# Altium project STM32WL_UFQFPN48_Reference_Design.PrjPcb
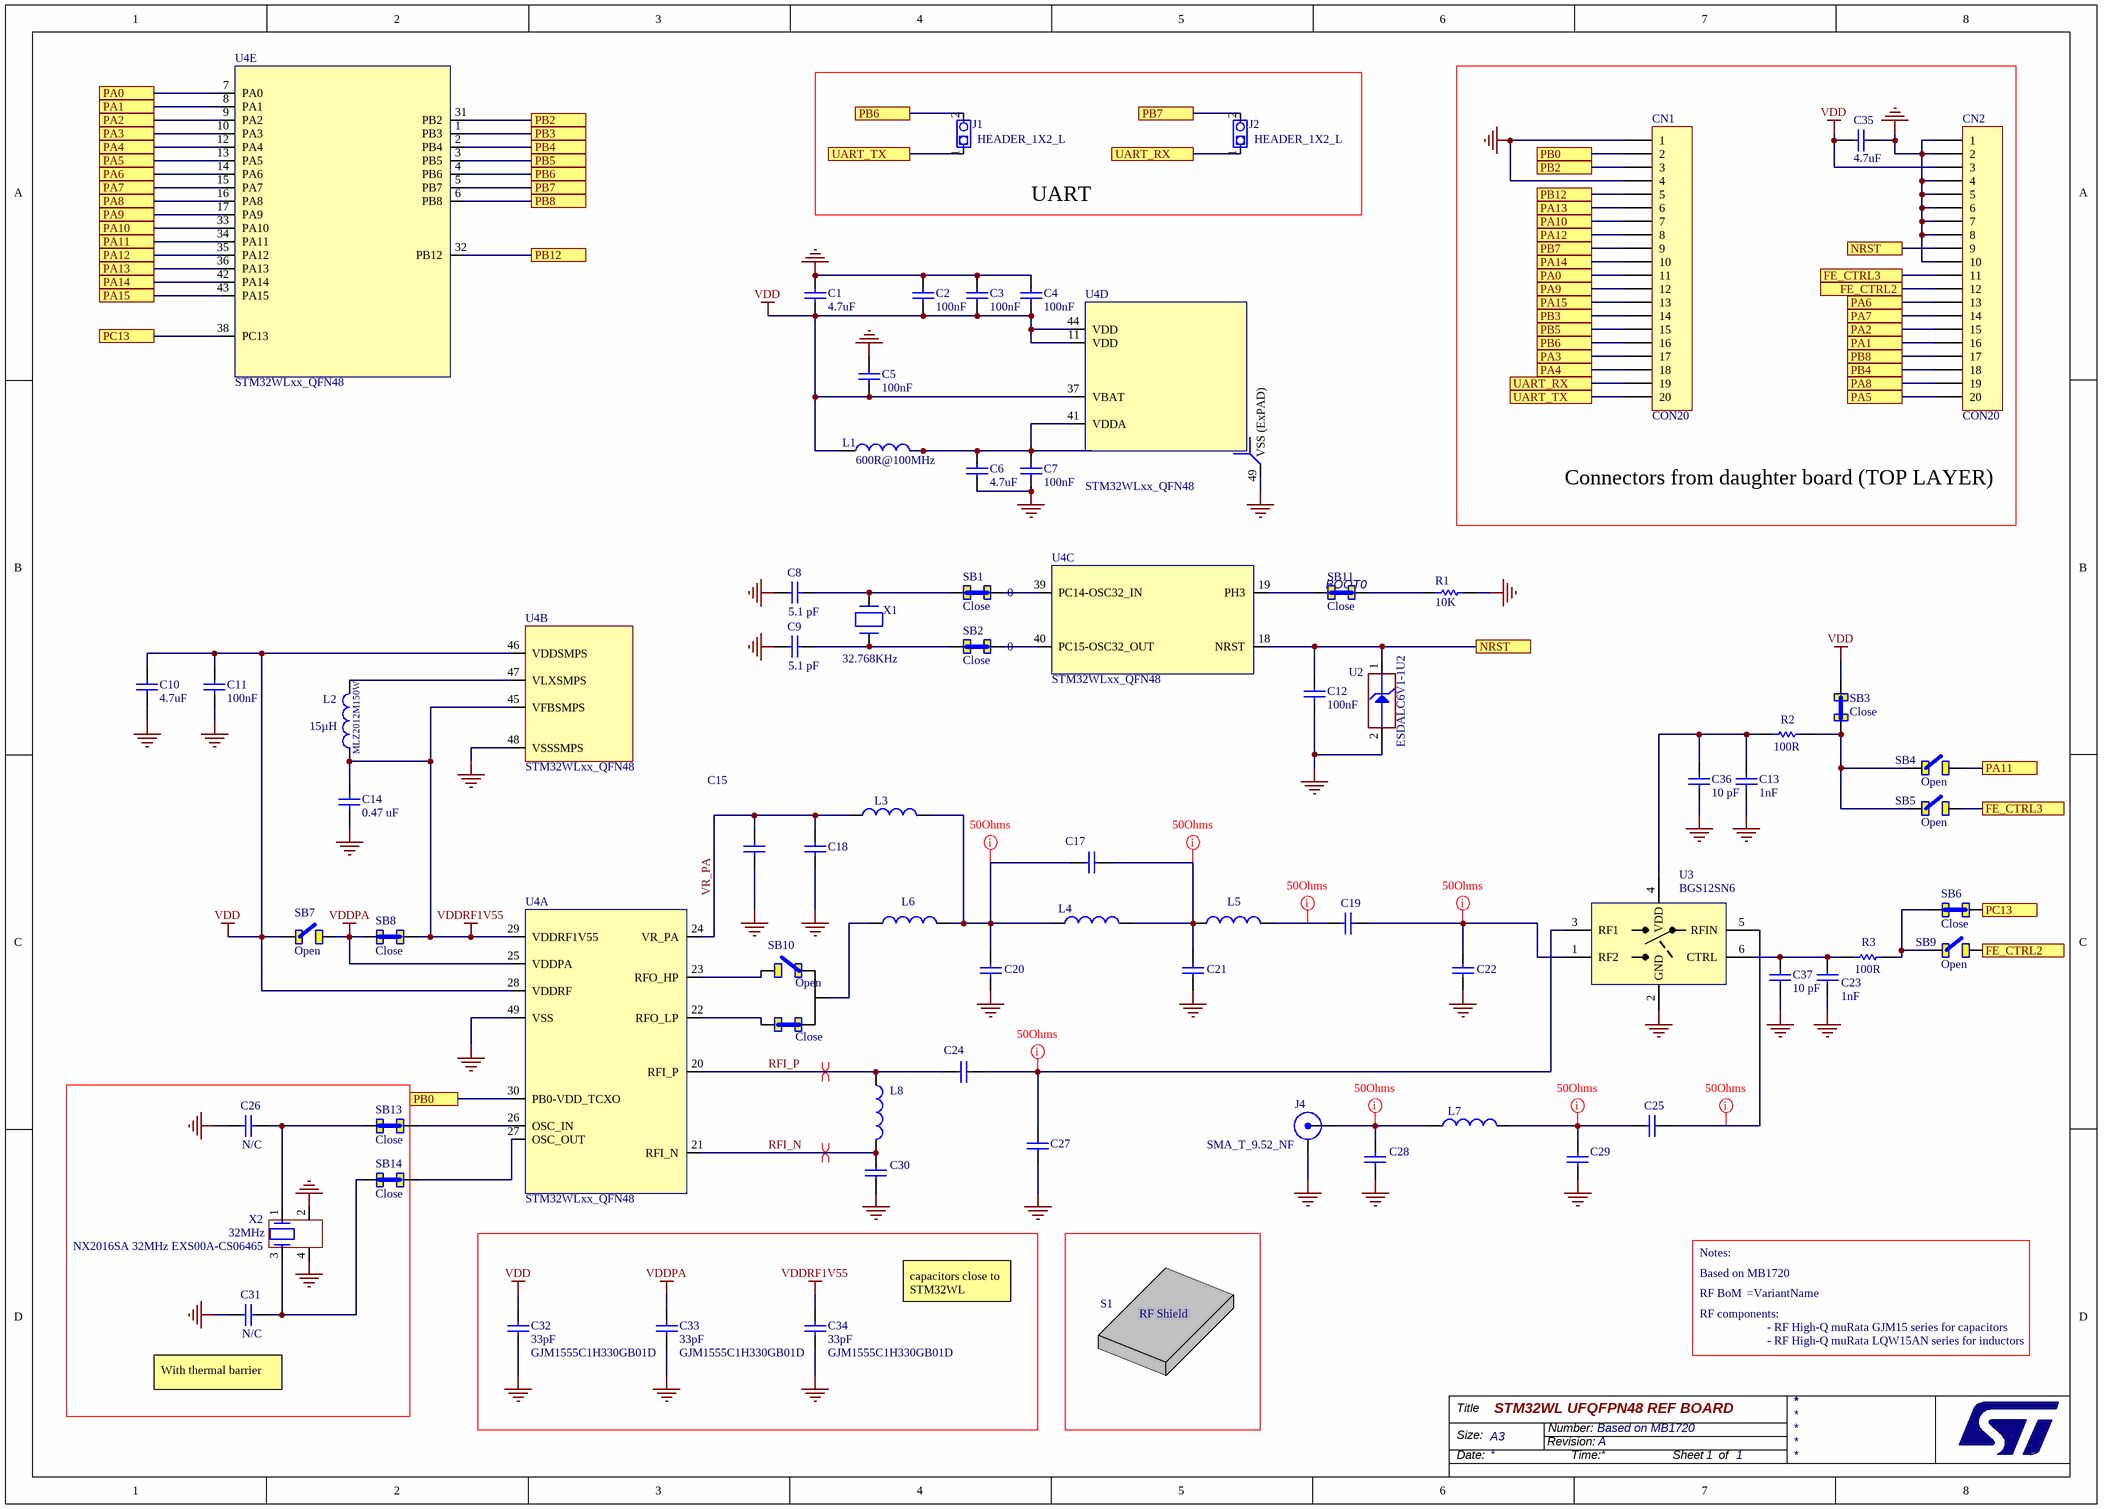
[diagram p0: STM32WL_UFQFPN48_Ref_Board.SchDoc]
1 sheet, 72 parts. Net scope: flat (ports and power ports of the same name join across sheets).
Board file: MB1720.PcbDoc

## Sheet STM32WL_UFQFPN48_Ref_Board.SchDoc: STM32WL UFQFPN48 REF BOARD
size A3; CheckedBy: HQDC; Engineer: HQDC; DocumentNumber: Based on MB1720; Revision: A; SheetNumber: 1; SheetTotal: 1

### Parts
C1  value 4.7uF  [CAPC1608X09N]
C2  value 100nF  [CAPC1005X06N]
C3  value 100nF  [CAPC1005X06N]
C4  value 100nF  [CAPC1005X06N]
C5  value 100nF  [CAPC1005X06N]
C6  value 4.7uF  [CAPC1608X09N]
C7  value 100nF  [CAPC1005X06N]
C8  value 5.1 pF  [CAPC1005X06N]  (hidden comment: Capacitor)
C9  value 5.1 pF  [CAPC1005X06N]  (hidden comment: Capacitor)
C10  value 4.7uF  [CAPC1608X09N]
C11  value 100nF  [CAPC1005X06N]
C12  value 100nF  [CAPC1005X06N]
C13  value 1nF  [CAPC1005X06N]
C14  value 0.47 uF  [CAPC1608X09N]
C15  (no value)  [CAPC1005X06N]
C17  (no value)  [CAPC1005X06N]
C18  (no value)  [CAPC1005X06N]
C19  (no value)  [CAPC1005X06N]
C20  (no value)  [CAPC1005X06N]
C21  (no value)  [CAPC1005X06N]
C22  (no value)  [CAPC1005X06N]
C23  value 1nF  [CAPC1005X06N]
C24  (no value)  [CAPC1005X06N]
C25  (no value)  [CAPC1005X06N]
C26  value N/C  [CAPC1005X06N]  (hidden comment: Capacitor)
C27  (no value)  [CAPC1005X06N]
C28  (no value)  [CAPC1005X06N - duplicate - duplicate]
C29  (no value)  [CAPC1005X06N - duplicate - duplicate]
C30  (no value)  [CAPC1005X06N]
C31  value N/C  [CAPC1005X06N]  (hidden comment: Capacitor)
C32  value 33pF  Manufacturer_Part_Number: GJM1555C1H330GB01D  [CAPC1005X06N]
C33  value 33pF  Manufacturer_Part_Number: GJM1555C1H330GB01D  [CAPC1005X06N]
C34  value 33pF  Manufacturer_Part_Number: GJM1555C1H330GB01D  [CAPC1005X06N]
C35  value 4.7uF  [CAPC1608X09N]
C36  value 10 pF  [CAPC1005X06N]  (hidden comment: Capa_0402)
C37  value 10 pF  [CAPC1005X06N]  (hidden comment: Capa_0402)
CN1  CON20  [CO_SAMTEC_TSW-120-07-x-S]
CN2  CON20  [CO_SAMTEC_TSW-120-07-x-S]
J1  HEADER_1X2_L  [CO_MOLEX_22-03-2021]
J2  HEADER_1X2_L  [CO_MOLEX_22-03-2021]
J4  SMA_T_9.52_NF  [CO_SAMTEC_SMA-J-P-ST-EMI]
L1  value 600R@100MHz  [INDC1608X95N]
L2  value 15µH  Manufacturer_Part_Number: MLZ2012M150W  [INDC2012X13N]
L3  (no value)  [IND_MURATA_LQW15A]
L4  (no value)  [IND_MURATA_LQW15A]
L5  (no value)  [IND_MURATA_LQW15A]
L6  (no value)  [IND_MURATA_LQW15A]
L7  (no value)  [IND_MURATA_LQW15A]
L8  (no value)  [IND_MURATA_LQW15A]
R1  value 10K  [RESC1608X05N]
R2  value 100R  [RESC1005X04N]
R3  value 100R  [RESC1005X04N]
RF_BoM  RF-BOM  (value not drawn)  (mechanical)
S1  RF-Shield  (value not drawn)  (mechanical)
SB1  Close  value 0  [SB_0402]
SB2  Close  value 0  [SB_0402]
SB3  Close  [SB_0402]
SB4  Open  [SB_0402]
SB5  Open  [SB_0402]
SB6  Close  [SB_0402]
SB7  Open  [SB_0402]
SB8  Close  [SB_0402]
SB9  Open  [SB_0402]
SB10  SB_3Pads  [SB3Pads_0402]  (value not drawn)
SB11  Close  [SB_0402]
SB13  Close  [SB_0402]
SB14  Close  [SB_0402]
U2  Manufacturer_Part_Number: ESDALC6V1-1U2  [DIOM0603X03N]
U3  BGS12SN6  [SON40P70X40-6N]
U4  STM32WLxx_QFN48  [STM32WLxx_QFN48]  (parts A,B,C,D,E of 5)
X1  value 32.768KHz  [OSC_NDK_NX2012SA]  (hidden comment: XTAL_2_PINS)
X2  value 32MHz  Manufacturer_Part_Number: NX2016SA 32MHz EXS00A-CS06465  [OSC_NDK_NX2016SA]

### Blocks framed on the sheet
Connectors from daughter board (TOP LAYER): C35 CN1 CN2
UART: J1 J2

### Ports
FE_CTRL2, FE_CTRL3, NRST, PA0, PA1, PA2, PA3, PA4, PA5, PA6, PA7, PA8, PA9, PA10, PA11, PA12, PA13, PA14, PA15, PB0, PB2, PB3, PB4, PB5, PB6, PB7, PB8, PB12, PC13, UART_RX, UART_TX

### Nets
GND: C1.1 C2.1 C3.1 C4.1 C5.1 C6.2 C7.2 C8.2 C9.2 C10.2 C11.2 C12.2 C13.1 C14.2 C15.2 C18.1 C20.2 C21.1 C22.1 C23.1 C26.2 C27.1 C28.2 C29.2 C30.1 C31.2 C32.1 C33.1 C34.1 C35.2 C36.1 C37.1 CN1.1 CN1.4 CN2.1 CN2.2 CN2.4 CN2.5 CN2.6 CN2.7 CN2.8 CN2.10 J4.2(Y) R1.1 U2.2(GND) U3.2(GND) U4.48(VSSSMPS) U4.49(VSS_(ExPAD)) X2.2 X2.4
VDD: C1.2 C2.2 C3.2 C4.2 C5.2 C10.1 C11.1 C32.2 C35.1 CN2.3 L1.1 SB3.1 SB7.2 U4.11(VDD) U4.28(VDDRF) U4.37(VBAT) U4.44(VDD) U4.46(VDDSMPS)
VDDPA: C33.2 SB7.1 SB8.2 U4.25(VDDPA)
VDDRF1V55: C14.1 C34.2 L2.1 SB8.1 U4.29(VDDRF1V55) U4.45(VFBSMPS)
RFI_N: C30.2 L8.2 U4.21(RFI_N)
RFI_P: C24.1 L8.1 U4.20(RFI_P)
VR_PA: C15.1 C18.2 L3.2 U4.24(VR_PA)
NetC6_1: C6.1 C7.1 L1.2 U4.41(VDDA)
NetC8_1: C8.1 SB1.2 X1.2(X2)
NetC9_1: C9.1 SB2.2 X1.1(X1)
NetC12_1: C12.1 CN2.9 U2.1(IO1) U4.18(NRST) ; port NRST
NetC13_2: C13.2 C36.2 R2.1 U3.4(VDD)
NetC17_1: C17.1 C20.1 L3.1 L4.1 L6.1
NetC17_2: C17.2 C21.2 L4.2 L5.1
NetC19_1: C19.1 C22.2 U3.1(RF2)
NetC19_2: C19.2 L5.2
NetC23_2: C23.2 C37.2 R3.1 U3.6(CTRL)
NetC24_2: C24.2 C27.2 U3.3(RF1)
NetC25_1: C25.1 U3.5(RFIN)
NetC25_2: C25.2 C29.1 L7.1
NetC26_1: C26.1 SB13.2 X2.1
NetC28_1: C28.1 J4.1(X) L7.2
NetC31_1: C31.1 SB14.2 X2.3
NetCN1_2: CN1.2 U4.30(PB0-VDD_TCXO) ; port PB0
NetCN1_3: CN1.3 U4.31(PB2) ; port PB2
NetCN1_5: CN1.5 U4.32(PB12) ; port PB12
NetCN1_6: CN1.6 U4.36(PA13) ; port PA13
NetCN1_7: CN1.7 U4.33(PA10) ; port PA10
NetCN1_8: CN1.8 U4.35(PA12) ; port PA12
NetCN1_9: CN1.9 J2.2 U4.5(PB7) ; port PB7
NetCN1_10: CN1.10 U4.42(PA14) ; port PA14
NetCN1_11: CN1.11 U4.7(PA0) ; port PA0
NetCN1_12: CN1.12 U4.17(PA9) ; port PA9
NetCN1_13: CN1.13 U4.43(PA15) ; port PA15
NetCN1_14: CN1.14 U4.1(PB3) ; port PB3
NetCN1_15: CN1.15 U4.3(PB5) ; port PB5
NetCN1_16: CN1.16 J1.2 U4.4(PB6) ; port PB6
NetCN1_17: CN1.17 U4.10(PA3) ; port PA3
NetCN1_18: CN1.18 U4.12(PA4) ; port PA4
NetCN1_19: CN1.19 J2.1 ; port UART_RX
NetCN1_20: CN1.20 J1.1 ; port UART_TX
NetCN2_11: CN2.11 SB5.1 ; port FE_CTRL3
NetCN2_12: CN2.12 SB9.1 ; port FE_CTRL2
NetCN2_13: CN2.13 U4.14(PA6) ; port PA6
NetCN2_14: CN2.14 U4.15(PA7) ; port PA7
NetCN2_15: CN2.15 U4.9(PA2) ; port PA2
NetCN2_16: CN2.16 U4.8(PA1) ; port PA1
NetCN2_17: CN2.17 U4.6(PB8) ; port PB8
NetCN2_18: CN2.18 U4.2(PB4) ; port PB4
NetCN2_19: CN2.19 U4.16(PA8) ; port PA8
NetCN2_20: CN2.20 U4.13(PA5) ; port PA5
NetL2_2: L2.2 U4.47(VLXSMPS)
NetL6_2: L6.2 SB10.2
NetR1_2: R1.2 SB11.1
NetR2_2: R2.2 SB3.2 SB4.2 SB5.2
NetR3_2: R3.2 SB6.2 SB9.2
NetSB1_1: SB1.1 U4.39(PC14-OSC32_IN)
NetSB2_1: SB2.1 U4.40(PC15-OSC32_OUT)
NetSB4_1: SB4.1 U4.34(PA11) ; port PA11
NetSB6_1: SB6.1 U4.38(PC13) ; port PC13
NetSB10_1: SB10.1 U4.23(RFO_HP)
NetSB10_3: SB10.3 U4.22(RFO_LP)
NetSB11_2: SB11.2 U4.19(PH3)
NetSB13_1: SB13.1 U4.26(OSC_IN)
NetSB14_1: SB14.1 U4.27(OSC_OUT)

### Layout directives
differential pair: RFI_N, RFI_P
net class 50Ohms: NetC17_1, NetC17_2, NetC19_1, NetC19_2, NetC24_2, NetC25_1, NetC25_2, NetC28_1

### Notes on the sheet
- (near SB11) BOOT0
- Notes:
- capacitors close to STM32WL
- Based on MB1720
- RF components:
- (near C31) With thermal barrier
- (near RF_BoM) - RF High-Q muRata GJM15 series for capacitors
- (near RF_BoM) - RF High-Q muRata LQW15AN series for inductors
- Title
- Size:
- Date:
- A3
- Revision:
- Number:
- Time:
- Sheet
- of
- (in symbol RF-Shield) RF Shield
- (in symbol SB_3Pads) Open; Close

### Library data of the parts
C1 C6 C10 C35 = MCD-00009: Capacitor, MLCC, 4.7uF, 16V, X5R, 10%, 0603, T=0.8mm; Manufacturer_Part_Number: CC0603KRX5R7BB475; Manufacturer: YAGEO; Package: C0603
C2-C5 C7 C11 C12 = MCD-00102: Capacitor, MLCC, 100nF, 16V, X7R, 10%, 0402, T=0,5mm; Manufacturer_Part_Number: CC0402KRX7R7BB104; Manufacturer: YAGEO; Package: C0402
C8 C9 = MCD-00003: Capacitor, MLCC, 5.1 pF, 50V, NPO, +-0.1pF, 0402, T=0.5mm; Manufacturer_Part_Number: CC0402CRNPO9BN5R1; Manufacturer: YAGEO
C13 C23 = MCD-00198: Capacitor, MLCC, 1nF, 16V, X7R, 10%, 0402, T=0.5mm; Manufacturer_Part_Number: CC0402KRX7R7BB102; Manufacturer: YAGEO
C14 = MCD-00009: Capacitor, MLCC, 4.7 uF, 16V, X5R, 10%, 0603, T=0.8mm; Manufacturer_Part_Number: CC0603KRX5R7BB474; Manufacturer: YAGEO; Package: C0603
C15 C17-C19 C22 C24 C25 C27 C30 = MCD-01123
C20 C29 = MCD-00102: Package: C0402
C21 = MCD-00015
C26 C31 = MCD-00003: Capacitor, MLCC, 6.8pF, 50V, NPO, +-0.1pF, 0402, T=0.5mm
C28 = Capacitor: Package: C0402
C32-C34 = MCD-00277: Capacitor, MLCC, 33pF, 50V, NPO, 2%, 0402, T=0,5mm; Manufacturer: MURATA
C36 C37 = Capa_0402: 10pF ±1% 50V Ceramic Capacitor C0G, NP0 0402 (1005 Metric); Manufacturer_Part_Number: GJM1555C1H100FB01D; Manufacturer: MURATA
CN1 CN2 = CON20: Connector right-angle, pitch 2.54mm, 20 contacts; Manufacturer: SAMTEC; Manufacturer_Part_Number: TSW-120-07-L-S
J1 J2 = HEADER_1X2_L: Header 1x2 Through hole 2.54mm; Manufacturer: MOLEX; Manufacturer_Part_Number: 22-03-2021
J4 = SMA_T_9.52_NF: SMA Jack, Edge Mount, 50 Ohms; Manufacturer: SAMTEC; Manufacturer_Part_Number: SMA-J-P-H-ST-EM1
L1 = MCD-00047: SMD Chip ferrite bead, 600R@100MHz +/-25%, 350mA, 500mohm DC, 0603, T=0.8mm; Manufacturer_Part_Number: FCM1608KF-601T03; Manufacturer: TAI-TECH
L2 = MCD-01433: MLZ2012 Multilayer Shielded Inductor 15µH, ±5%; Manufacturer: TDK
L3-L8 = MCD-01330
R1 = MCD-00220: Resistor,10K,0603,1%,1/10W; Manufacturer_Part_Number: RC0603FR-0710KL; Manufacturer: YAGEO
R2 R3 = MCD-00119: Resistor,100R,0402,1%,1/16W; Manufacturer_Part_Number: RC0402FR-07100RL; Manufacturer: YAGEO
S1 = RF-Shield: RF Shield Frame + Cover without apertures; Manufacturer: Masach Tech; Manufacturer_Part_Number: MS409-10
SB1 SB2 = SB_0Ohm: Solder Bridge 0R [0402] (Populated with 0 Ohm); Manufacturer: Vishay / Dale; Manufacturer_Part_Number: RCS04020000Z0ED; Revision: July-2002: Re-released for DXP Platform.
SB3 SB6 SB8 SB13 SB14 = SB_0Ohm: Solder Bridge 0R [0402] (Populated with 0 Ohm); Manufacturer: Vishay / Dale; Manufacturer_Part_Number: RCS04020000Z0ED; VALUE: 0; Revision: July-2002: Re-released for DXP Platform.
SB4 SB5 SB7 SB9 = SB_Open: Solder Bridge Open [0402] (Unpopulated); Revision: July-2002: Re-released for DXP Platform.
SB10 = SB_3Pads: Solder Bridge
SB11 = SB_0Ohm: Solder Bridge 0R [0402] (Populated with 0 Ohm); Manufacturer: Vishay / Dale; Manufacturer_Part_Number: RCS04020000Z0ED; VALUE: 0 ohm; Revision: July-2002: Re-released for DXP Platform.
U2 = MCD-00170: ESD protection 6V1; Manufacturer: STMICROELECTRONICS
U3 = BGS12SN6: DC switch - Ultra-Low  SPDT analog switch; Manufacturer: INFINEON; Manufacturer_Part_Number: BGS12SN6
U4 = STM32WLxx_QFN48: HQDC : Verified April, 25 2019; Manufacturer: STMicroelectronics; Manufacturer_Part_Number: STM32WLxxxx
X1 = MCD-01479: Crystal 32.768kHz, 6pF, -+20PPM, R=80K, SMD; Manufacturer_Part_Number: NX2012SA 32.768KHz EXS00A-MU00527; Manufacturer: NDK
X2 = MCD-01446: Crystal 32 MHz, 8pF, -+10 PPM, R=60Ω, SMD; Manufacturer: NDK

## Assembly variants
+14dBm_868-915MHz: all parts fitted
+22dBm_868-915MHz: all parts fitted
+14dBm_433MHz: all parts fitted
+22dBm_490MHz: all parts fitted